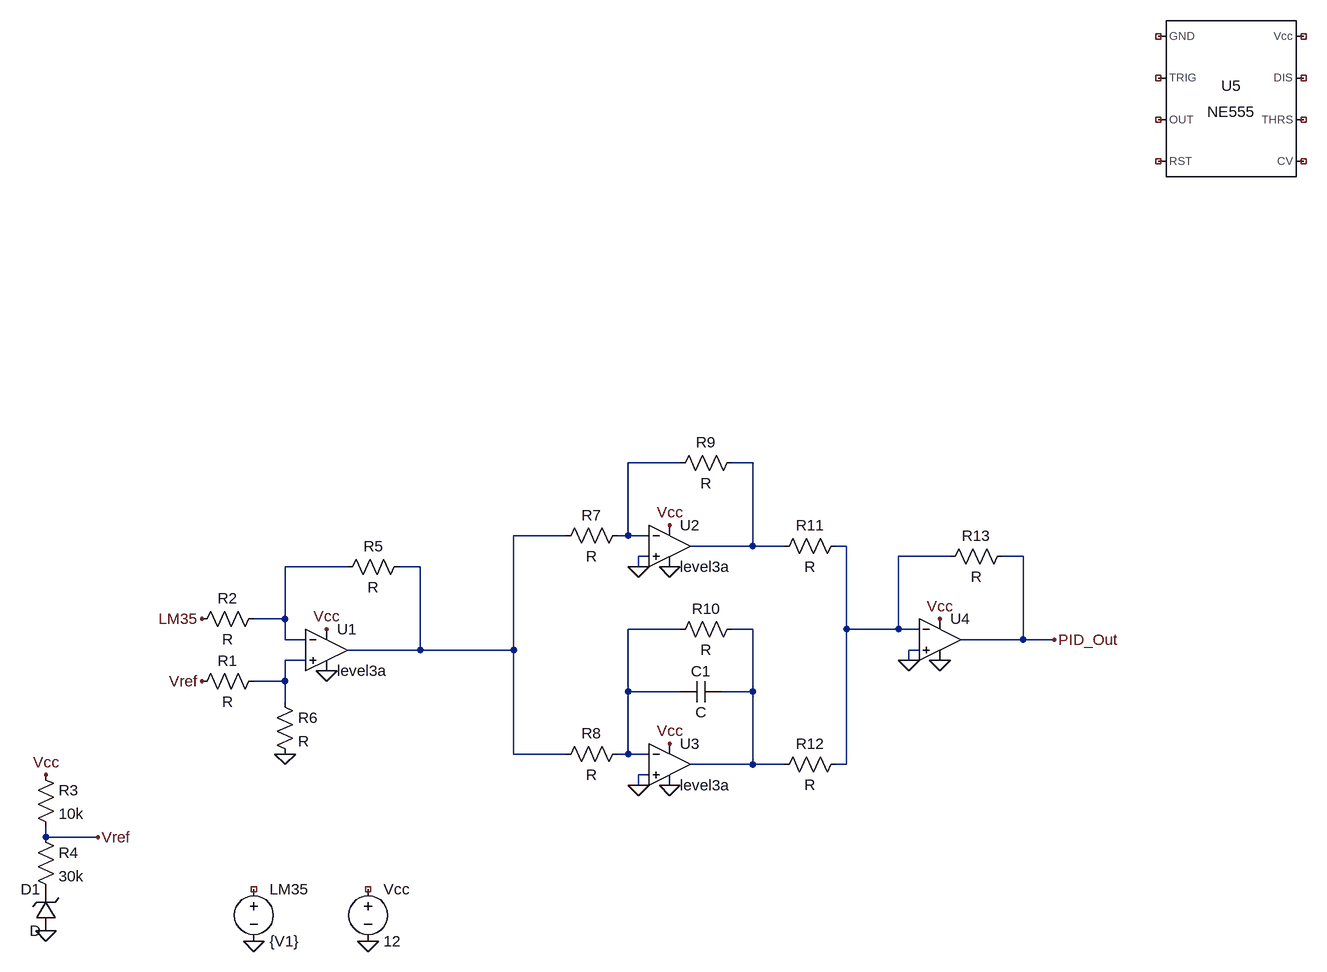
[diagram p0: schematic Draft1.asc]
Draft1.asc, the LTspice schematic file:
Version 4
SHEET 1 1704 680
WIRE 736 -80 656 -80
WIRE 848 -80 816 -80
WIRE 560 32 480 32
WIRE 656 32 656 -80
WIRE 656 32 640 32
WIRE 688 32 656 32
WIRE 848 48 848 -80
WIRE 848 48 752 48
WIRE 896 48 848 48
WIRE 992 48 976 48
WIRE 688 64 672 64
WIRE 1152 64 1072 64
WIRE 1264 64 1232 64
WIRE 224 80 128 80
WIRE 336 80 304 80
WIRE 672 80 672 64
WIRE 128 160 128 80
WIRE 128 160 80 160
WIRE 736 176 656 176
WIRE 848 176 816 176
WIRE 992 176 992 48
WIRE 1072 176 1072 64
WIRE 1072 176 992 176
WIRE 1104 176 1072 176
WIRE 128 192 128 160
WIRE 160 192 128 192
WIRE 1264 192 1264 64
WIRE 1264 192 1168 192
WIRE 1312 192 1264 192
WIRE 336 208 336 80
WIRE 336 208 224 208
WIRE 480 208 480 32
WIRE 480 208 336 208
WIRE 1104 208 1088 208
WIRE 160 224 128 224
WIRE 1088 224 1088 208
WIRE 128 256 128 224
WIRE 128 256 80 256
WIRE 656 272 656 176
WIRE 736 272 656 272
WIRE 848 272 848 176
WIRE 848 272 800 272
WIRE 128 288 128 256
WIRE 480 368 480 208
WIRE 560 368 480 368
WIRE 656 368 656 272
WIRE 656 368 640 368
WIRE 688 368 656 368
WIRE 848 384 848 272
WIRE 848 384 752 384
WIRE 896 384 848 384
WIRE 992 384 992 176
WIRE 992 384 976 384
WIRE 688 400 672 400
WIRE 672 416 672 400
WIRE -240 496 -240 480
WIRE -160 496 -240 496
FLAG 192 240 0
FLAG 720 80 0
FLAG 720 416 0
FLAG 80 656 0
FLAG 256 656 0
FLAG 192 176 Vcc
FLAG -240 640 0
FLAG -240 400 Vcc
FLAG -160 496 Vref
FLAG 0 256 Vref
FLAG 0 160 LM35
FLAG 128 368 0
FLAG 672 416 0
FLAG 672 80 0
FLAG 720 352 Vcc
FLAG 720 16 Vcc
FLAG 1088 224 0
FLAG 1136 224 0
FLAG 1136 160 Vcc
FLAG 1312 192 PID_Out
SYMBOL OpAmps/UniversalOpAmp3 192 208 R0
SYMATTR InstName U1
SYMBOL OpAmps/UniversalOpAmp3 720 48 R0
SYMATTR InstName U2
SYMBOL OpAmps/UniversalOpAmp3 720 384 R0
SYMATTR InstName U3
SYMBOL Voltage 80 560 R0
SYMATTR InstName LM35
SYMATTR Value {V1}
SYMBOL Voltage 256 560 R0
SYMATTR InstName Vcc
SYMATTR Value 12
SYMBOL Res 96 240 R90
WINDOW 0 0 56 VBottom 2
WINDOW 3 32 56 VTop 2
SYMATTR InstName R1
SYMBOL Res 96 144 R90
WINDOW 0 0 56 VBottom 2
WINDOW 3 32 56 VTop 2
SYMATTR InstName R2
SYMBOL Res -256 384 R0
SYMATTR InstName R3
SYMATTR Value 10k
SYMBOL zener -224 640 R180
WINDOW 0 24 64 Left 2
WINDOW 3 24 0 Left 2
SYMATTR InstName D1
SYMBOL Res -256 480 R0
SYMATTR InstName R4
SYMATTR Value 30k
SYMBOL Res 320 64 R90
WINDOW 0 0 56 VBottom 2
WINDOW 3 32 56 VTop 2
SYMATTR InstName R5
SYMBOL Res 112 272 R0
SYMATTR InstName R6
SYMBOL Res 656 16 R90
WINDOW 0 0 56 VBottom 2
WINDOW 3 32 56 VTop 2
SYMATTR InstName R7
SYMBOL Res 656 352 R90
WINDOW 0 0 56 VBottom 2
WINDOW 3 32 56 VTop 2
SYMATTR InstName R8
SYMBOL Res 832 -96 R90
WINDOW 0 0 56 VBottom 2
WINDOW 3 32 56 VTop 2
SYMATTR InstName R9
SYMBOL Res 832 160 R90
WINDOW 0 0 56 VBottom 2
WINDOW 3 32 56 VTop 2
SYMATTR InstName R10
SYMBOL Cap 800 256 R90
WINDOW 0 0 32 VBottom 2
WINDOW 3 32 32 VTop 2
SYMATTR InstName C1
SYMBOL Res 992 32 R90
WINDOW 0 0 56 VBottom 2
WINDOW 3 32 56 VTop 2
SYMATTR InstName R11
SYMBOL Res 992 368 R90
WINDOW 0 0 56 VBottom 2
WINDOW 3 32 56 VTop 2
SYMATTR InstName R12
SYMBOL OpAmps/UniversalOpAmp 1136 192 R0
SYMATTR InstName U4
SYMBOL Res 1248 48 R90
WINDOW 0 0 56 VBottom 2
WINDOW 3 32 56 VTop 2
SYMATTR InstName R13
SYMBOL Misc/NE555 1584 -640 R0
SYMATTR InstName U5

The netlist it stands for:
* Draft1.asc
XU1 N008 N005 Vcc 0 N003 level3a  ; pins In+ In- V+ V- OUT
XU2 0 N001 Vcc 0 N002 level3a  ; pins In+ In- V+ V- OUT
XU3 0 N006 Vcc 0 N007 level3a  ; pins In+ In- V+ V- OUT
V§LM35 NC_01 0 {V1}
Vcc NC_02 0 12
R1 N008 Vref R
R2 N005 LM35 R
R3 Vcc Vref 10k
D1 0 P001 D
R4 Vref P001 30k
R5 N003 N005 R
R6 N008 0 R
R7 N001 N003 R
R8 N006 N003 R
R9 N002 N001 R
R10 N007 N006 R
C1 N007 N006 C
R11 N004 N002 R
R12 N004 N007 R
XU4 0 N004 Vcc 0 PID_Out level1 Avol=1Meg GBW=10Meg Vos=0 En=0 Enk=0 In=0 Ink=0 Rin=500Meg  ; pins In+ In- V+ V- OUT
R13 PID_Out N004 R
XU5 NC_03 NC_04 NC_05 NC_06 NC_07 NC_08 NC_09 NC_10 NE555  ; pins GND TRIG OUT RST CV THRS DIS Vcc
.model D D
.lib standard.dio
.lib UniversalOpAmp1.lib
.lib NE555.sub
.backanno
.end